# Altium schematic sheet Sheet2.SchDoc
size A; SheetNumber: 2; SheetTotal: 2
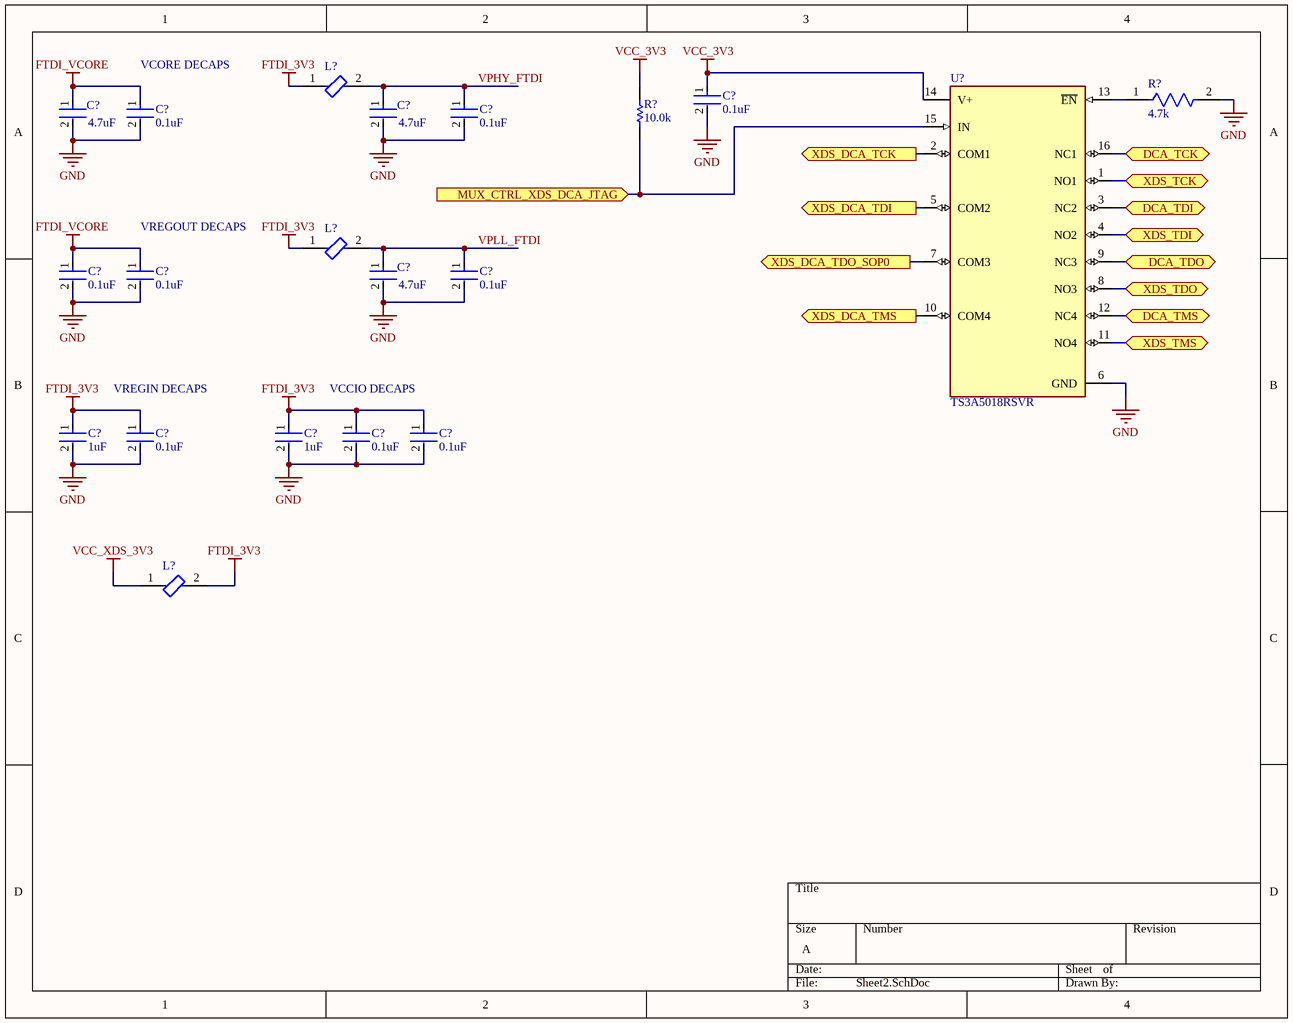
[diagram p0: Sheet2.SchDoc]

## Parts
(Parts that share a designator on the sheet are numbered #1, #2 ... from top to bottom, then left to right.)
C?#1  0.1uF  [FP-C0402-BB-MFG]
C?#2  4.7uF  [FP-C1608-080-MFG]
C?#3  0.1uF  [FP-C0402-BB-MFG]
C?#4  4.7uF  [FP-C1608-080-MFG]
C?#5  0.1uF  [FP-C0402-BB-MFG]
C?#6  0.1uF  [FP-C0402-BB-MFG]
C?#7  0.1uF  [FP-C0402-BB-MFG]
C?#8  4.7uF  [FP-C1608-080-MFG]
C?#9  0.1uF  [FP-C0402-BB-MFG]
C?#10  1uF  [FP-GCM188-0_1-IPC_B]
C?#11  0.1uF  [FP-C0402-BB-MFG]
C?#12  1uF  [FP-GCM188-0_1-IPC_B]
C?#13  0.1uF  [FP-C0402-BB-MFG]
C?#14  0.1uF  [FP-C0402-BB-MFG]
L?#1  (no value)  [FP-BLM15-0_05-IPC_C]
L?#2  (no value)  [FP-BLM15-0_05-IPC_C]
L?#3  (no value)  [FP-BLM15-0_05-IPC_C]
R?#1  4.7k  [FP-CRCW0402-e3-IPC_A]
R?#2  10.0k  [RESC1005X40X25ML05T10]
U?  TS3A5018RSVR  [FP-RSV0016A-MFG]

## Ports
DCA_TCK (bidir), DCA_TDI (bidir), DCA_TDO (bidir), DCA_TMS (bidir), MUX_CTRL_XDS_DCA_JTAG (in), XDS_DCA_TCK (out), XDS_DCA_TDI (out), XDS_DCA_TDO_SOP0 (out), XDS_DCA_TMS (out), XDS_TCK (bidir), XDS_TDI (bidir), XDS_TDO (bidir), XDS_TMS (bidir)

## Nets
 VCC_3V3: C?#1.1 R?#2.2 U?.14(V+)
FTDI_3V3: C?#10.1 C?#11.1 C?#12.1 C?#13.1 C?#14.1 L?#1.1 L?#2.1 L?#3.2
FTDI_VCORE: C?#2.1 C?#3.1 C?#6.1 C?#7.1
GND: C?#1.2 C?#2.2 C?#3.2 C?#4.2 C?#5.2 C?#6.2 C?#7.2 C?#8.2 C?#9.2 C?#10.2 C?#11.2 C?#12.2 C?#13.2 C?#14.2 R?#1.2 U?.6(GND)
VCC_XDS_3V3: L?#3.1
DCA_TCK: U?.16(NC1) ; port DCA_TCK
DCA_TDI: U?.3(NC2) ; port DCA_TDI
DCA_TDO: U?.9(NC3) ; port DCA_TDO
DCA_TMS: U?.12(NC4) ; port DCA_TMS
MUX_CTRL_XDS_DCA_JTAG: R?#2.1 U?.15(IN) ; port MUX_CTRL_XDS_DCA_JTAG
VPHY_FTDI: C?#4.1 C?#5.1 L?#1.2
VPLL_FTDI: C?#8.1 C?#9.1 L?#2.2
XDS_DCA_TCK: U?.2(COM1) ; port XDS_DCA_TCK
XDS_DCA_TDI: U?.5(COM2) ; port XDS_DCA_TDI
XDS_DCA_TDO_SOP0: U?.7(COM3) ; port XDS_DCA_TDO_SOP0
XDS_DCA_TMS: U?.10(COM4) ; port XDS_DCA_TMS
XDS_TCK: U?.1(NO1) ; port XDS_TCK
XDS_TDI: U?.4(NO2) ; port XDS_TDI
XDS_TDO: U?.8(NO3) ; port XDS_TDO
XDS_TMS: U?.11(NO4) ; port XDS_TMS
NetR?#1_1: R?#1.1 U?.13(~{EN})

## Notes on the sheet
- (near C?#3) VCORE DECAPS
- (near C?#7) VREGOUT DECAPS
- (near C?#11) VREGIN DECAPS
- (near C?#13) VCCIO DECAPS

## Library data of the parts
C?#1 C?#3 C?#5-C?#7 C?#9 C?#11 C?#13 C?#14 = CMP-2008-03086-2: CAP CER 0.1UF 10V X7R 0402; Manufacturer Part Number: C0402C104K8RACTU; Manufacturer: Kemet; Capacitance: 0.10 μF; Tolerance: 0.1; Temperature Coefficient: 15%; Value: 0.10 μF; Material: Ceramic; Automotive: No; Temperature Range High: +125°C; Octopart: https://octopart.com/c0402c104k8ractu-kemet-106349; ComponentLink2Description: Datasheet; ComponentLink2URL: https://content.kemet.com/datasheets/KEM_C1002_X7R_SMD.pdf; Temperature: -55°C to +125°C; RoHS: TRUE; Temperature Range Low: -55°C; Temperature Characteristic: X7R; Lead Free: Yes; Height: 0.55mm; Voltage Rating: 10 V; Category: Cap; Device Class L3: Ceramic Capacitors; Digikey Description: CAP CER 0.1UF 10V X7R 0402; Package: C0402-BB; Device Class L1: Passive Components; Ipc Land Pattern Name: CAPC10050X50; Mouser Description: Multilayer Ceramic Capacitors MLCC - SMD/SMT 10volts 0.1uF X7R 10%; Device Class L2: Capacitors
C?#2 C?#4 C?#8 = CMP-08246-005491-1: CAP CER 4.7UF 10V X7S 0603; Dielectric Material: Ceramic; Interface: I2C; Frequency: 48MHz; Memory Type: FLASH; Peripherals: Brown-out Detect/Reset; Tolerance: 10%; Oscillator Type: Internal; Number of I/Os: 53; Core Architecture: ARM; Memory Size: 64KB; Voltage Rating: 10V; Lead Free: Lead Free; Case Code (Imperial): 0603; Voltage Rating (DC): 10V; Series: Leopard Gecko; Min Operating Temperature: -40°C; Case/Package: LFBGA; Dielectric: X7S; RoHS Compliant: Yes; Package Quantity: 1000; Capacitance: 4.7uF; Thickness: 800um; Number of Pins: 64; REACH SVHC: No SVHC; Length: 1.6mm; Max Operating Temperature: 125°C; Depth: 0.8mm; Packaging: Tape and Reel; Case Code (Metric): 1608
C?#10 C?#12 = CMP-2006-02357-2: Ceramic Capacitor for Automotive 1uF  ±10% 16VDC X7R 0603 Paper T/R; Voltage: 16V; Thickness: 0.035inch; Width: 0.031inch; Radiation Hardening: No; Depth: 0.8mm; Max Operating Temperature: 125°C; Package Quantity: 1; Ratings: AEC-Q200; Min Operating Temperature: -55°C; Packaging: Tape and Reel; Case Code (Metric): 1608; REACH SVHC: No SVHC; Dielectric: X7R; Case Code (Imperial): 0603; Length: 1.6mm; Height: 0.8mm; Voltage Rating: 16V; Termination: SMD/SMT; Case/Package: 0603; Voltage Rating (DC): 16V; Tolerance: 10%; Capacitance: 1uF; Mount: Surface Mount; Lead Free: Lead Free
L?#1-L?#3 = CMP-0686-00290-4: Chip Ferrite Bead, 0402, 600Ω @ 100MHz, 0.7Ω, 25%, 300mA; DC Resistance-Max: 700mR; Number of Lines: 1; Impedance: 600R; Material: Steel; Shielding: Unshielded; Frequency: 100MHz; Test Frequency: 100MHz; Radiation Hardening: No; Series: BLM15H; Case Code (Metric): 1005; Core Material: Ferrite; Length: 1mm; DC Current: 300mA; Tolerance: 25%; DC Resistance (DCR): 700mR; Number of Pins: 2; Min Operating Temperature: -55°C; Width: 0.5mm; Lead Free: Lead Free; Case/Package: 0402; REACH SVHC: No SVHC; Height: 0.5mm; Max Current Rating: 300mA; Depth: 0.5mm; Military Standard: Not; Package Quantity: 1; Case Code (Imperial): 0402; Number of Circuits: 1; Termination: SMD/SMT; Max DC Current: 300mA; Current Rating: 300mA; Packaging: Tape and Reel; Max Operating Temperature: 125°C
R?#1 = CMP-2002-00052-3: RES Thick Film, 4.7kΩ, 5%, 0.063W, 200ppm/°C, 0402; Power Rating: 63mW; Resistance: 4.7kR; Voltage Rating: 50V; Case Code (Metric): 1005; Case/Package: 0402; Composition: Thick Film; Depth: 0.5mm; Min Operating Temperature: -55°C; Temperature Coefficient: 200ppm/°C; Max Power Dissipation: 63mW; Packaging: Tape and Reel; Max Operating Temperature: 155°C; Number of Terminations: 2; Width: 0.5mm; Height: 0.35mm; Contact Plating: Tin; Package Quantity: 1; Length: 1mm; Termination: SMD/SMT; Radiation Hardening: No; Weight: 2.3E-05oz; Military Standard: Not; Case Code (Imperial): 0402; Features: Automotive AEC-Q200; Tolerance: 5%
R?#2 = CMP-2002-03043-1: Part Number: CRCW040210K0FKEDHP; Manufacturer: Vishay Dale
U? = CMP-04892-000084-1: IC SWITCH QUAD SPDT 16UQFN; Min Supply Voltage: 2.3V; Supply Current: 2.5uA; On-State Resistance: 10R; Supply Type: Single; Max Supply Current: 10uA; Turn-On Delay Time: 9ns; Bandwidth: 300MHz; Turn-Off Delay Time: 7ns; Number of Outputs: 8; Max Supply Voltage: 3.6V; Number of Channels: 4; Throw Configuration: SPDT; Height: 0.5mm; Width: 1.85mm; Packaging: Tape and Reel; Number of Pins: 16; Lead Free: Lead Free; Length: 2.65mm; REACH SVHC: No SVHC; RoHS Compliant: Yes; Max Operating Temperature: 85°C; Package Quantity: 1; Nominal Supply Current: 2.5uA; Mount: Surface Mount; Min Operating Temperature: -40°C; Radiation Hardening: No; Operating Supply Current: 2.5uA; Series: -; Number of Inputs: 4